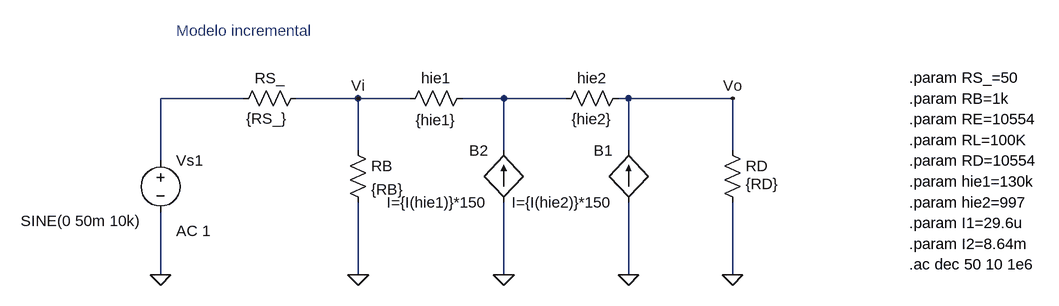
[diagram p0: schematic dummy.asc]
dummy.asc, the LTspice schematic file:
Version 4
SHEET 1 2424 724
WIRE 1152 -16 1024 -16
WIRE 1328 -16 1232 -16
WIRE 1408 -16 1328 -16
WIRE 1552 -16 1488 -16
WIRE 1648 -16 1552 -16
WIRE 1744 -16 1728 -16
WIRE 1904 -16 1744 -16
WIRE 1328 64 1328 -16
WIRE 1552 64 1552 -16
WIRE 1744 64 1744 -16
WIRE 1904 64 1904 -16
WIRE 1024 80 1024 -16
WIRE 1024 256 1024 160
WIRE 1328 256 1328 144
WIRE 1552 256 1552 144
WIRE 1744 256 1744 144
WIRE 1904 256 1904 144
FLAG 1024 256 0
FLAG 1328 256 0
FLAG 1552 256 0
FLAG 1744 256 0
FLAG 1904 256 0
FLAG 1328 -16 Vi
FLAG 1904 -16 Vo
SYMBOL voltage 1024 64 R0
WINDOW 123 24 124 Left 2
WINDOW 39 0 0 Left 0
WINDOW 3 -215 109 Left 2
SYMATTR Value2 AC 1
SYMATTR Value SINE(0 50m 10k)
SYMATTR InstName Vs1
SYMBOL res 1248 -32 R90
WINDOW 0 0 56 VBottom 2
WINDOW 3 63 61 VBottom 2
SYMATTR InstName RS_
SYMATTR Value {RS_}
SYMBOL res 1312 48 R0
SYMATTR InstName RB
SYMATTR Value {RB}
SYMBOL res 1392 0 R270
WINDOW 0 32 56 VTop 2
WINDOW 3 -33 56 VTop 2
SYMATTR InstName hie1
SYMATTR Value {hie1}
SYMBOL res 1888 48 R0
WINDOW 3 36 68 Left 2
SYMATTR Value {RD}
SYMATTR InstName RD
SYMBOL res 1632 0 R270
WINDOW 0 32 56 VTop 2
WINDOW 3 0 56 VBottom 2
SYMATTR InstName hie2
SYMATTR Value {hie2}
SYMBOL bi 1744 144 R180
WINDOW 0 24 80 Left 2
WINDOW 3 24 0 Left 2
SYMATTR InstName B1
SYMATTR Value I={I(hie2)}*150
SYMBOL bi 1552 144 R180
WINDOW 0 24 80 Left 2
WINDOW 3 24 0 Left 2
SYMATTR InstName B2
SYMATTR Value I={I(hie1)}*150
TEXT 1048 -120 Left 2 ;Modelo incremental
TEXT 2176 -48 Left 2 !.param RS_=50
TEXT 2176 -16 Left 2 !.param RB=1k
TEXT 2176 16 Left 2 !.param RE=10554
TEXT 2176 48 Left 2 !.param RL=100K
TEXT 2176 80 Left 2 !.param RD=10554
TEXT 2176 112 Left 2 !.param hie1=130k
TEXT 2176 144 Left 2 !.param hie2=997
TEXT 2176 176 Left 2 !.param I1=29.6u
TEXT 2176 208 Left 2 !.param I2=8.64m
TEXT 2176 240 Left 2 !.ac dec 50 10 1e6

The netlist it stands for:
* dummy.asc
Vs1 N001 0 SINE(0 50m 10k) AC 1
RS_ Vi N001 {RS_}
RB Vi 0 {RB}
R§hie1 Vi N002 {hie1}
RD Vo 0 {RD}
R§hie2 N002 Vo {hie2}
B1 0 Vo I={I(hie2)}*150
B2 0 N002 I={I(hie1)}*150
* Modelo incremental
.param RS_=50
.param RB=1k
.param RE=10554
.param RL=100K
.param RD=10554
.param hie1=130k
.param hie2=997
.param I1=29.6u
.param I2=8.64m
.ac dec 50 10 1e6
.backanno
.end